# EAGLE schematic bilancia_smart_pezzi_ali_cc (EAGLE 7.3.0)
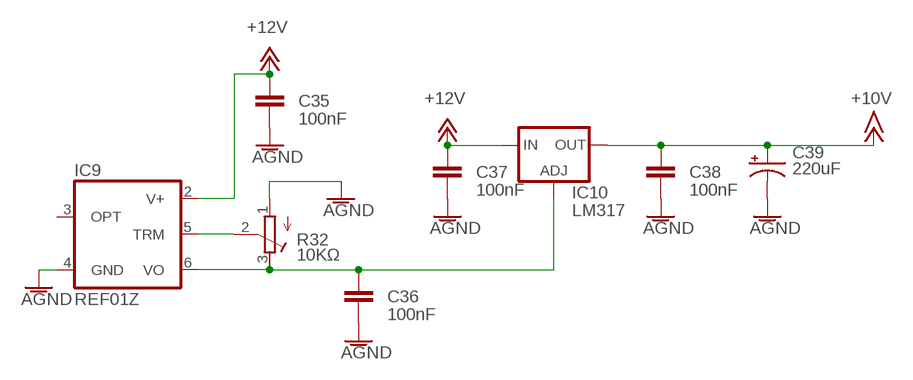
[diagram p0: schematic, sheet 1]

## Parts
C35  100nF  C2.5/2  [C2.5-2]
C36  100nF  C2.5/2  [C2.5-2]
C37  100nF  C2.5/2  [C2.5-2]
C38  100nF  C2.5/2  [C2.5-2]
C39  220uF  CAP_POLPTH1  [CPOL-RADIAL-100UF-25V]
IC9  REF01Z  [DIL08]
IC10  LM317  LM317TS  [317TS]
R32  10KΩ  R-TRIMM64W  [RTRIM64W]

## Nets
+12V [massa]: C35.2 C37.2 IC9.2(V+) IC10.3(IN)
+15V: C38.2 C39.1(+) IC10.2(OUT) ; supply symbol labelled +10V
AGND [massa]: C35.1 C36.1 C37.1 C38.1 C39.2(-) IC9.4(GND) R32.1(E)
N$42: C36.2 IC9.6(VO) IC10.1(ADJ) R32.3(A)
N$43: IC9.5(TRM) R32.2(S)
Unconnected: IC9.3(OPT)

## Library data of the parts
C35-C38 = capacitor-wima:C: CAPACITOR naming: grid - package width
C39 = SparkFun-Capacitors:CAP_POL: Capacitor Polarized These are standard SMD and PTH capacitors. Normally 10uF, 47uF, and 100uF in electrolytic and tantalum varieties. Always verify the external diameter of the through hole cap, it varies with capacity, voltage, and manufacturer. The EIA devices should be standard.
IC9 = linear:REF01: VOLTAGE REFERENCE
IC10 = v-reg:LM317TS: VOLTAGE REGULATOR
R32 = resistor:R-TRIMM: Trimm resistor

## Net classes
0 default: clearance 0.205 mm
1 massa: width 0.5 mm, clearance 0.205 mm